# EAGLE design sml-lx0404-breakout (EAGLE 9.6.2)
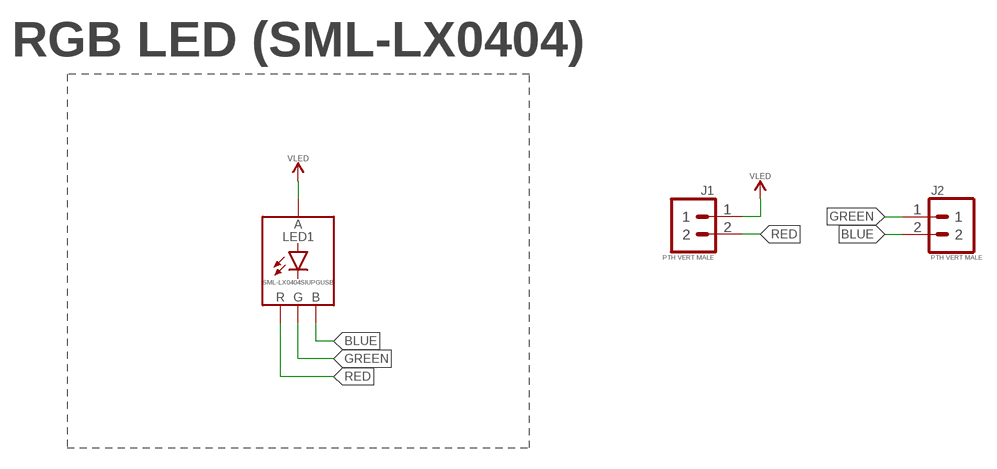
[diagram p0: schematic, sheet 1]

## Parts
J1  PTH VERT MALE  1X02_PTH_VERT_MALE_2.54MM  [HDRV2W64P254_1X2_508X254X838B]
J2  PTH VERT MALE  1X02_PTH_VERT_MALE_2.54MM  [HDRV2W64P254_1X2_508X254X838B]
LED1  SML-LX0404SIUPGUSB  [DIODFN100X100X30-4N]

## Nets
BLUE: J2.2 LED1.3(B)
GREEN: J2.1 LED1.4(G)
RED: J1.2 LED1.2(R)
VLED: J1.1 LED1.1(A)

## Notes on the sheet
- RGB LED (SML-LX0404)

## Library data of the parts
J1 J2 = _connectors:1X02: 2 Positions Header Connector 0.079" (2.00mm) Through Hole Tin; DATASHEET: https://drawings-pdf.s3.amazonaws.com/C10436.pdf; DIST: Digikey; DISTLINK: https://www.digikey.com/products/en?keywords=S1012E-02-ND; DISTPN: S1012E-02-ND; MFR: Sullins Connector Solutions; MPN: PEC02SAAN
LED1 = _leds:SML-LX0404SIUPGUSB; DATASHEET: https://media.digikey.com/pdf/Data%20Sheets/Lumex%20PDFs/SML-LX0404SIUPGUSB.pdf; DIST: Digikey; DISTLINK: https://www.digikey.com/en/products/detail/lumex-opto-components-inc/SML-LX0404SIUPGUSB/2509880?s=N4IgTCBcDaIGwHYC0YCMYCsTVIHIBEQBdAXyA; DISTPN: 67-2125-1-ND; MFR: Lumex Opto/Components Inc.; MPN: SML-LX0404SIUPGUSB

## Board
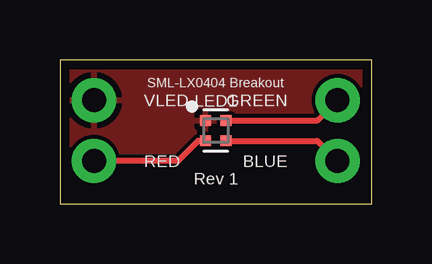
[diagram p1: board, top side]
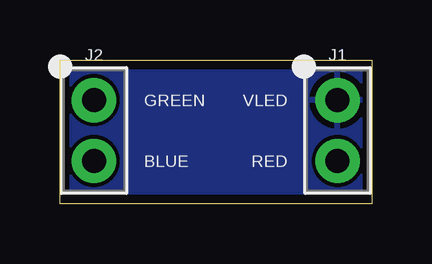
[diagram p2: board, bottom side, seen from below]

Size 13 x 6 mm. Coordinates in mm from the lower left corner, seen from the top.
Outline: 0,0 13,0 13,6 0,6 0,0
Copper layers (1*16): Top 0.035559375mm / dielectric 1.6mm / Bottom 0.035559375mm
Design rules "oshpark-2layer": minimum track width 6mil, minimum drill 10mil, track to track 6mil, track to pad 6mil, pad to pad 6mil, via to via 6mil, smd to smd 6mil, copper to edge 15mil, drill to drill 6mil, minimum pad ring 5mil, minimum via ring 5mil, stop-mask expansion 2.5mil, vias tented up to drill 0mil, thermal gap 10mil

### Footprints (pad centres in the part's own frame; a part is rotated, then mirrored left to right if it is on the bottom)
HDRV2W64P254_1X2_508X254X838B = drill 1 pad 1.85: 1 -1.27,0; 2 1.27,0
DIODFN100X100X30-4N = smd 0.45 x 0.45: 1 -0.425,0.425; 2 -0.425,-0.425; 3 0.425,-0.425; 4 0.425,0.425

### Placement (x,y rotation side)
J1  1.42,3.05 270 bottom
J2  11.58,3.05 270 bottom
LED1  6.5,3.05 0 top

### Tracks (layer width: path | path; a pad name or v marks a point on that pad's centre or on a via)
BLUE
  Top 0.254: LED1.3 10.73,2.62 J2.2
GREEN
  Top 0.254: LED1.4 10.73,3.47 J2.1
RED
  Top 0.254: LED1.2 5.76,2.62 4.92,1.78 J1.2
VLED
  pour Top: 0,0 13,0 13,6 0,6
  pour Bottom: 0,0 13,0 13,6 0,6

### Text on the board
tPlace: SML-LX0404 Breakout | VLED | GREEN | RED | BLUE | Rev 1
bPlace: VLED | GREEN | RED | BLUE